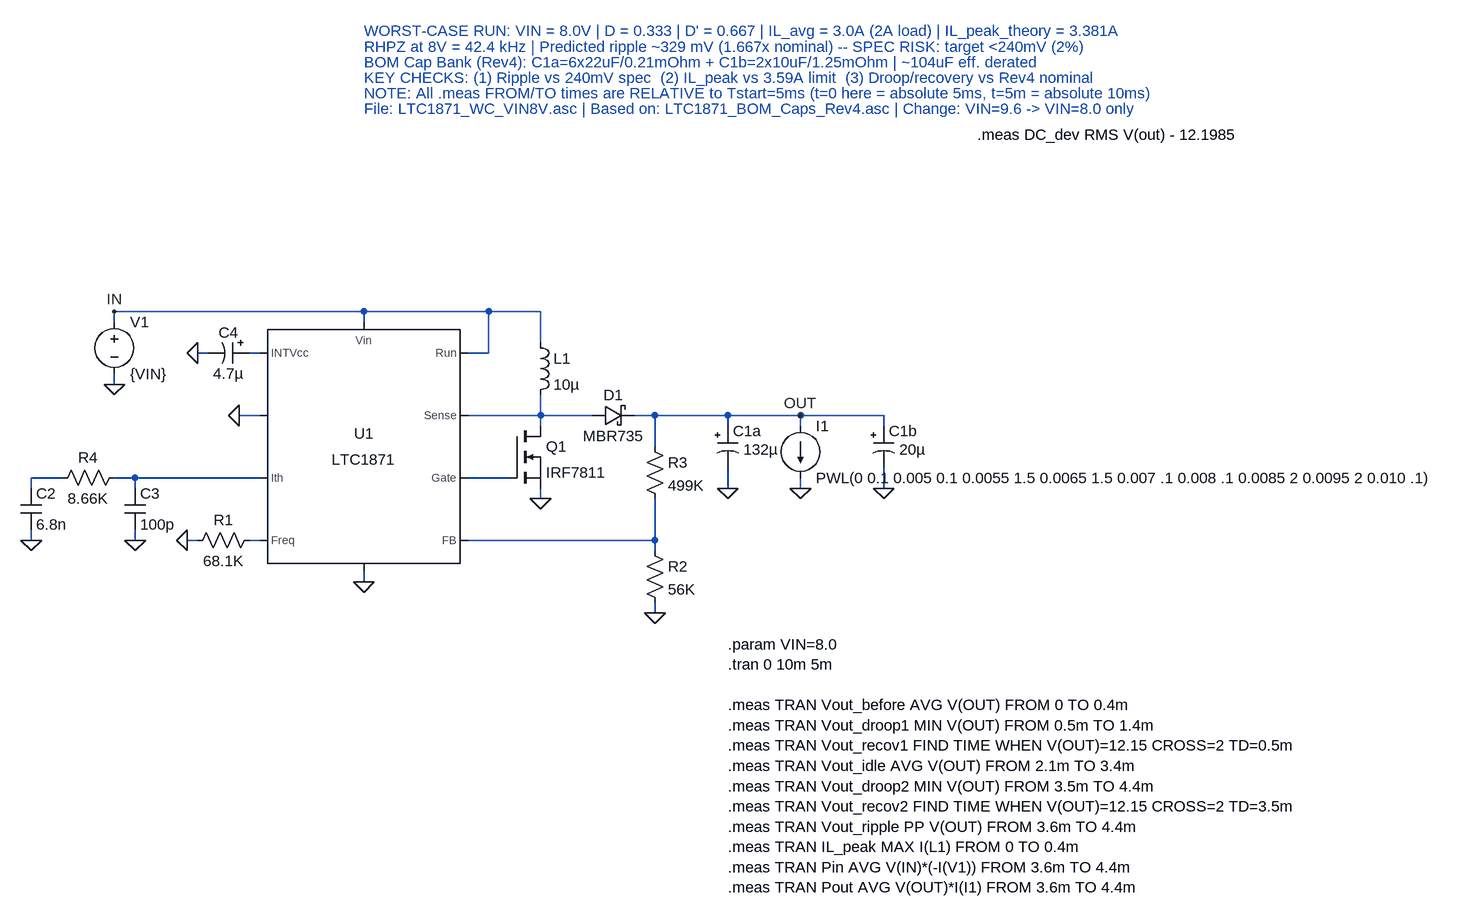
[diagram p0: schematic LTC1871_WC_VIN8V.asc]
LTC1871_WC_VIN8V.asc, the LTspice schematic file:
Version 4.1
SHEET 1 5664 2264
WIRE 1632 1168 1248 1168
WIRE 1824 1168 1632 1168
WIRE 1904 1168 1824 1168
WIRE 1248 1184 1248 1168
WIRE 1632 1184 1632 1168
WIRE 1904 1216 1904 1168
WIRE 1392 1232 1376 1232
WIRE 1472 1232 1456 1232
WIRE 1824 1232 1824 1168
WIRE 1824 1232 1792 1232
WIRE 1248 1280 1248 1264
WIRE 1472 1328 1440 1328
WIRE 1904 1328 1904 1296
WIRE 1904 1328 1792 1328
WIRE 1984 1328 1904 1328
WIRE 2080 1328 2048 1328
WIRE 2192 1328 2080 1328
WIRE 2304 1328 2192 1328
WIRE 2432 1328 2304 1328
WIRE 1904 1344 1904 1328
WIRE 2192 1344 2192 1328
WIRE 2304 1344 2304 1328
WIRE 2432 1344 2432 1328
WIRE 2080 1376 2080 1328
WIRE 1168 1424 1120 1424
WIRE 1280 1424 1248 1424
WIRE 1472 1424 1280 1424
WIRE 1856 1424 1792 1424
WIRE 1120 1440 1120 1424
WIRE 1280 1440 1280 1424
WIRE 2192 1440 2192 1408
WIRE 2304 1440 2304 1424
WIRE 2432 1440 2432 1408
WIRE 1904 1456 1904 1440
WIRE 1120 1520 1120 1504
WIRE 1280 1520 1280 1504
WIRE 1376 1520 1360 1520
WIRE 1472 1520 1456 1520
WIRE 2080 1520 2080 1456
WIRE 2080 1520 1792 1520
WIRE 2080 1536 2080 1520
WIRE 1632 1584 1632 1568
WIRE 2080 1632 2080 1616
FLAG 1904 1456 0
FLAG 1360 1520 0
FLAG 2080 1632 0
FLAG 1632 1584 0
FLAG 2192 1440 0
FLAG 1280 1520 0
FLAG 1120 1520 0
FLAG 2304 1440 0
FLAG 2432 1440 0
FLAG 1248 1280 0
FLAG 1440 1328 0
FLAG 1376 1232 0
FLAG 2304 1328 OUT
FLAG 1248 1168 IN
SYMBOL NMOS 1856 1344 R0
SYMATTR InstName Q1
SYMATTR Value IRF7811
SYMBOL RES 1472 1504 R90
WINDOW 0 0 56 VBottom 2
WINDOW 3 32 56 VTop 2
SYMATTR InstName R1
SYMATTR Value 68.1K
SYMBOL res 2064 1520 R0
SYMATTR InstName R2
SYMATTR Value 56K
SYMBOL res 2064 1360 R0
SYMATTR InstName R3
SYMATTR Value 499K
SYMBOL ind 1888 1200 R0
SYMATTR InstName L1
SYMATTR Value 10µ
SYMBOL schottky 1984 1344 R270
WINDOW 0 32 32 VTop 2
WINDOW 3 0 32 VBottom 2
SYMATTR InstName D1
SYMATTR Value MBR735
SYMBOL polcap 2176 1344 R0
WINDOW 40 27 64 Left 2
WINDOW 3 40 36 Left 2
SYMATTR Value 132µ
SYMATTR InstName C1a
SYMATTR SpiceLine Rser=0.00021
SYMBOL polcap 2416 1344 R0
WINDOW 40 27 64 Left 2
WINDOW 3 40 36 Left 2
SYMATTR Value 20µ
SYMATTR InstName C1b
SYMATTR SpiceLine Rser=0.00125
SYMBOL res 1264 1408 R90
WINDOW 0 0 56 VBottom 2
WINDOW 3 32 56 VTop 2
SYMATTR InstName R4
SYMATTR Value 8.66K
SYMBOL cap 1104 1440 R0
SYMATTR InstName C2
SYMATTR Value 6.8n
SYMBOL cap 1264 1440 R0
SYMATTR InstName C3
SYMATTR Value 100p
SYMBOL POWERPRODUCTS\\LTC1871 1632 1376 R0
SYMATTR InstName U1
SYMBOL VOLTAGE 1248 1168 R0
WINDOW 123 0 0 Left 0
WINDOW 39 0 0 Left 0
SYMATTR InstName V1
SYMATTR Value {VIN}
SYMBOL polcap 1456 1216 R90
WINDOW 0 0 32 VBottom 2
WINDOW 3 32 32 VTop 2
SYMATTR InstName C4
SYMATTR Value 4.7µ
SYMBOL current 2304 1344 R0
WINDOW 123 0 0 Left 0
WINDOW 39 0 0 Left 0
SYMATTR InstName I1
SYMATTR Value PWL(0 0.1 0.005 0.1 0.0055 1.5 0.0065 1.5 0.007 .1 0.008 .1 0.0085 2 0.0095 2 0.010 .1)
TEXT 2192 1680 Left 2 !.param VIN=8.0\n.tran 0 10m 5m\n \n.meas TRAN Vout_before AVG V(OUT) FROM 0 TO 0.4m\n.meas TRAN Vout_droop1 MIN V(OUT) FROM 0.5m TO 1.4m\n.meas TRAN Vout_recov1 FIND TIME WHEN V(OUT)=12.15 CROSS=2 TD=0.5m\n.meas TRAN Vout_idle AVG V(OUT) FROM 2.1m TO 3.4m\n.meas TRAN Vout_droop2 MIN V(OUT) FROM 3.5m TO 4.4m\n.meas TRAN Vout_recov2 FIND TIME WHEN V(OUT)=12.15 CROSS=2 TD=3.5m\n.meas TRAN Vout_ripple PP V(OUT) FROM 3.6m TO 4.4m\n.meas TRAN IL_peak MAX I(L1) FROM 0 TO 0.4m\n.meas TRAN Pin AVG V(IN)*(-I(V1)) FROM 3.6m TO 4.4m\n.meas TRAN Pout AVG V(OUT)*I(I1) FROM 3.6m TO 4.4m
TEXT 2576 896 Left 2 !.meas DC_dev RMS V(out) - 12.1985
TEXT 1632 736 Left 2 ;WORST-CASE RUN: VIN = 8.0V | D = 0.333 | D' = 0.667 | IL_avg = 3.0A (2A load) | IL_peak_theory = 3.381A
TEXT 1632 760 Left 2 ;RHPZ at 8V = 42.4 kHz | Predicted ripple ~329 mV (1.667x nominal) -- SPEC RISK: target <240mV (2%)
TEXT 1632 784 Left 2 ;BOM Cap Bank (Rev4): C1a=6x22uF/0.21mOhm + C1b=2x10uF/1.25mOhm | ~104uF eff. derated
TEXT 1632 808 Left 2 ;KEY CHECKS: (1) Ripple vs 240mV spec  (2) IL_peak vs 3.59A limit  (3) Droop/recovery vs Rev4 nominal
TEXT 1632 832 Left 2 ;NOTE: All .meas FROM/TO times are RELATIVE to Tstart=5ms (t=0 here = absolute 5ms, t=5m = absolute 10ms)
TEXT 1632 856 Left 2 ;File: LTC1871_WC_VIN8V.asc | Based on: LTC1871_BOM_Caps_Rev4.asc | Change: VIN=9.6 -> VIN=8.0 only

The netlist it stands for:
* LTC1871_WC_VIN8V.asc
M§Q1 N002 N005 0 0 IRF7811
R1 N006 0 68.1K
R2 N007 0 56K
R3 OUT N007 499K
L1 IN N002 10µ
D1 N002 OUT MBR735
C1a OUT 0 132µ Rser=0.00021
C1b OUT 0 20µ Rser=0.00125
R4 N004 N003 8.66K
C2 N003 0 6.8n
C3 N004 0 100p
X§U1 IN N004 N007 N006 0 0 N005 N001 IN N002 LTC1871  ; pins Run Ith FB Freq ? ? Gate INTVcc Vin Sense
V1 IN 0 {VIN}
C4 N001 0 4.7µ
I1 OUT 0 PWL(0 0.1 0.005 0.1 0.0055 1.5 0.0065 1.5 0.007 .1 0.008 .1 0.0085 2 0.0095 2 0.010 .1)
.model D D
.lib standard.dio
.model NMOS NMOS
.model PMOS PMOS
.lib standard.mos
.param VIN=8.0
.tran 0 10m 5m
.meas TRAN Vout_before AVG V(OUT) FROM 0 TO 0.4m
.meas TRAN Vout_droop1 MIN V(OUT) FROM 0.5m TO 1.4m
.meas TRAN Vout_recov1 FIND TIME WHEN V(OUT)=12.15 CROSS=2 TD=0.5m
.meas TRAN Vout_idle AVG V(OUT) FROM 2.1m TO 3.4m
.meas TRAN Vout_droop2 MIN V(OUT) FROM 3.5m TO 4.4m
.meas TRAN Vout_recov2 FIND TIME WHEN V(OUT)=12.15 CROSS=2 TD=3.5m
.meas TRAN Vout_ripple PP V(OUT) FROM 3.6m TO 4.4m
.meas TRAN IL_peak MAX I(L1) FROM 0 TO 0.4m
.meas TRAN Pin AVG V(IN)*(-I(V1)) FROM 3.6m TO 4.4m
.meas TRAN Pout AVG V(OUT)*I(I1) FROM 3.6m TO 4.4m
.meas DC_dev RMS V(out) - 12.1985
* WORST-CASE RUN: VIN = 8.0V | D = 0.333 | D' = 0.667 | IL_avg = 3.0A (2A load) | IL_peak_theory = 3.381A
* RHPZ at 8V = 42.4 kHz | Predicted ripple ~329 mV (1.667x nominal) -- SPEC RISK: target <240mV (2%)
* BOM Cap Bank (Rev4): C1a=6x22uF/0.21mOhm + C1b=2x10uF/1.25mOhm | ~104uF eff. derated
* KEY CHECKS: (1) Ripple vs 240mV spec  (2) IL_peak vs 3.59A limit  (3) Droop/recovery vs Rev4 nominal
* NOTE: All .meas FROM/TO times are RELATIVE to Tstart=5ms (t=0 here = absolute 5ms, t=5m = absolute 10ms)
* File: LTC1871_WC_VIN8V.asc | Based on: LTC1871_BOM_Caps_Rev4.asc | Change: VIN=9.6 -> VIN=8.0 only
.lib LTC1871.sub
.backanno
.end